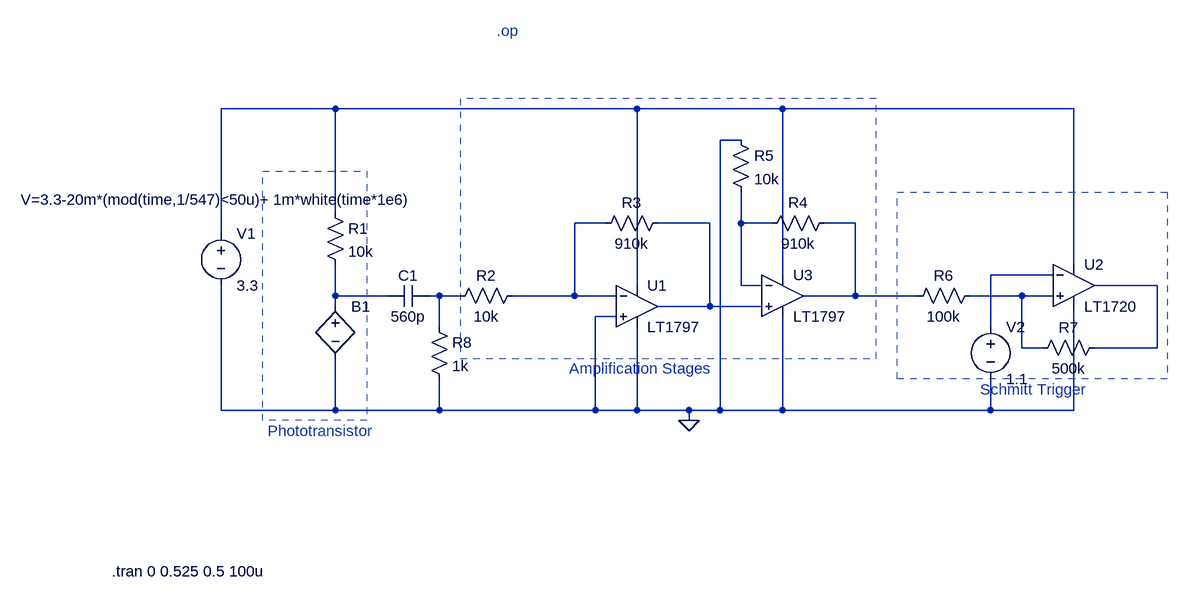
[diagram p0: schematic IR Sensor Final.asc]
IR Sensor Final.asc, the LTspice schematic file:
Version 4.1
SHEET 1 1604 780
WIRE -176 -176 -352 -176
WIRE 288 -176 -176 -176
WIRE 512 -176 288 -176
WIRE 960 -176 512 -176
WIRE 448 -128 416 -128
WIRE -176 -16 -176 -176
WIRE 240 0 192 0
WIRE 400 0 320 0
WIRE 448 0 448 -48
WIRE 496 0 448 0
WIRE 624 0 576 0
WIRE -352 16 -352 -176
WIRE 960 64 960 -176
WIRE 512 80 512 -176
WIRE 928 80 832 80
WIRE 288 96 288 -176
WIRE 448 96 448 0
WIRE 480 96 448 96
WIRE 1088 96 992 96
WIRE -176 112 -176 64
WIRE -96 112 -176 112
WIRE -16 112 -32 112
WIRE 16 112 -16 112
WIRE 192 112 192 0
WIRE 192 112 96 112
WIRE 256 112 192 112
WIRE 624 112 624 0
WIRE 624 112 544 112
WIRE 720 112 624 112
WIRE 880 112 800 112
WIRE 928 112 880 112
WIRE -176 128 -176 112
WIRE 400 128 400 0
WIRE 400 128 320 128
WIRE 480 128 400 128
WIRE 256 144 224 144
WIRE -16 160 -16 112
WIRE 832 160 832 80
WIRE 880 192 880 112
WIRE 912 192 880 192
WIRE 1088 192 1088 96
WIRE 1088 192 992 192
WIRE -352 288 -352 96
WIRE -176 288 -176 208
WIRE -176 288 -352 288
WIRE -16 288 -16 240
WIRE -16 288 -176 288
WIRE 224 288 224 144
WIRE 224 288 -16 288
WIRE 288 288 288 160
WIRE 288 288 224 288
WIRE 368 288 288 288
WIRE 416 288 416 -128
WIRE 416 288 368 288
WIRE 512 288 512 144
WIRE 512 288 416 288
WIRE 832 288 832 240
WIRE 832 288 512 288
WIRE 960 288 960 128
WIRE 960 288 832 288
WIRE 368 304 368 288
FLAG 368 304 0
SYMBOL OpAmps\\LT1797 288 64 R0
SYMATTR InstName U1
SYMBOL Comparators\\LT1720 960 32 R0
SYMATTR InstName U2
SYMBOL res 112 96 R90
WINDOW 0 0 56 VBottom 2
WINDOW 3 32 56 VTop 2
SYMATTR InstName R2
SYMATTR Value 10k
SYMBOL res 336 -16 R90
WINDOW 0 0 56 VBottom 2
WINDOW 3 32 56 VTop 2
SYMATTR InstName R3
SYMATTR Value 910k
SYMBOL OpAmps\\LT1797 512 48 R0
SYMATTR InstName U3
SYMBOL res 592 -16 R90
WINDOW 0 0 56 VBottom 2
WINDOW 3 32 56 VTop 2
SYMATTR InstName R4
SYMATTR Value 910k
SYMBOL res 432 -144 R0
SYMATTR InstName R5
SYMATTR Value 10k
SYMBOL res 816 96 R90
WINDOW 0 0 56 VBottom 2
WINDOW 3 32 56 VTop 2
SYMATTR InstName R6
SYMATTR Value 100k
SYMBOL res 1008 176 R90
WINDOW 0 0 56 VBottom 2
WINDOW 3 32 56 VTop 2
SYMATTR InstName R7
SYMATTR Value 500k
SYMBOL cap -32 96 R90
WINDOW 0 0 32 VBottom 2
WINDOW 3 32 32 VTop 2
SYMATTR InstName C1
SYMATTR Value 560p
SYMBOL res -192 -32 R0
SYMATTR InstName R1
SYMATTR Value 10k
SYMBOL voltage 832 144 R0
WINDOW 123 0 0 Left 0
WINDOW 39 0 0 Left 0
SYMATTR InstName V2
SYMATTR Value 1.1
SYMBOL voltage -352 0 R0
SYMATTR InstName V1
SYMATTR Value 3.3
SYMBOL bv -176 112 R0
WINDOW 3 -484 -148 Left 2
SYMATTR InstName B1
SYMATTR Value V=3.3-20m*(mod(time,1/547)<50u)+ 1m*white(time*1e6)
SYMBOL res -32 144 R0
SYMATTR InstName R8
SYMATTR Value 1k
TEXT -520 536 Left 2 !.tran 0 0.525 0.5 100u
TEXT -280 320 Left 2 ;Phototransistor
TEXT 184 224 Left 2 ;Amplification Stages
TEXT 816 256 Left 2 ;Schmitt Trigger
TEXT 72 -296 Left 2 ;.op
RECTANGLE Normal -128 304 -288 -80 2
RECTANGLE Normal 1104 240 688 -48 2
RECTANGLE Normal 16 208 656 -192 2
RECTANGLE Normal -288 -80 -288 -80 2

The netlist it stands for:
* IR Sensor Final.asc
X§U1 0 N002 N001 0 N003 LT1797  ; pins In+ In- V+ V- OUT
X§U2 N010 N006 N001 0 N007 LT1720  ; pins In+ In- V+ V- OUT
R2 N002 N009 10k
R3 N003 N002 910k
X§U3 N003 N004 N001 0 N005 LT1797  ; pins In+ In- V+ V- OUT
R4 N005 N004 910k
R5 0 N004 10k
R6 N010 N005 100k
R7 N007 N010 500k
C1 N009 N008 560p
R1 N001 N008 10k
V2 N006 0 1.1
V1 N001 0 3.3
B1 N008 0 V=3.3-20m*(mod(time,1/547)<50u)+ 1m*white(time*1e6)
R8 N009 0 1k
.tran 0 0.525 0.5 100u
* Phototransistor
* Amplification Stages
* Schmitt Trigger
* .op
.lib LT1720.sub
.backanno
.end